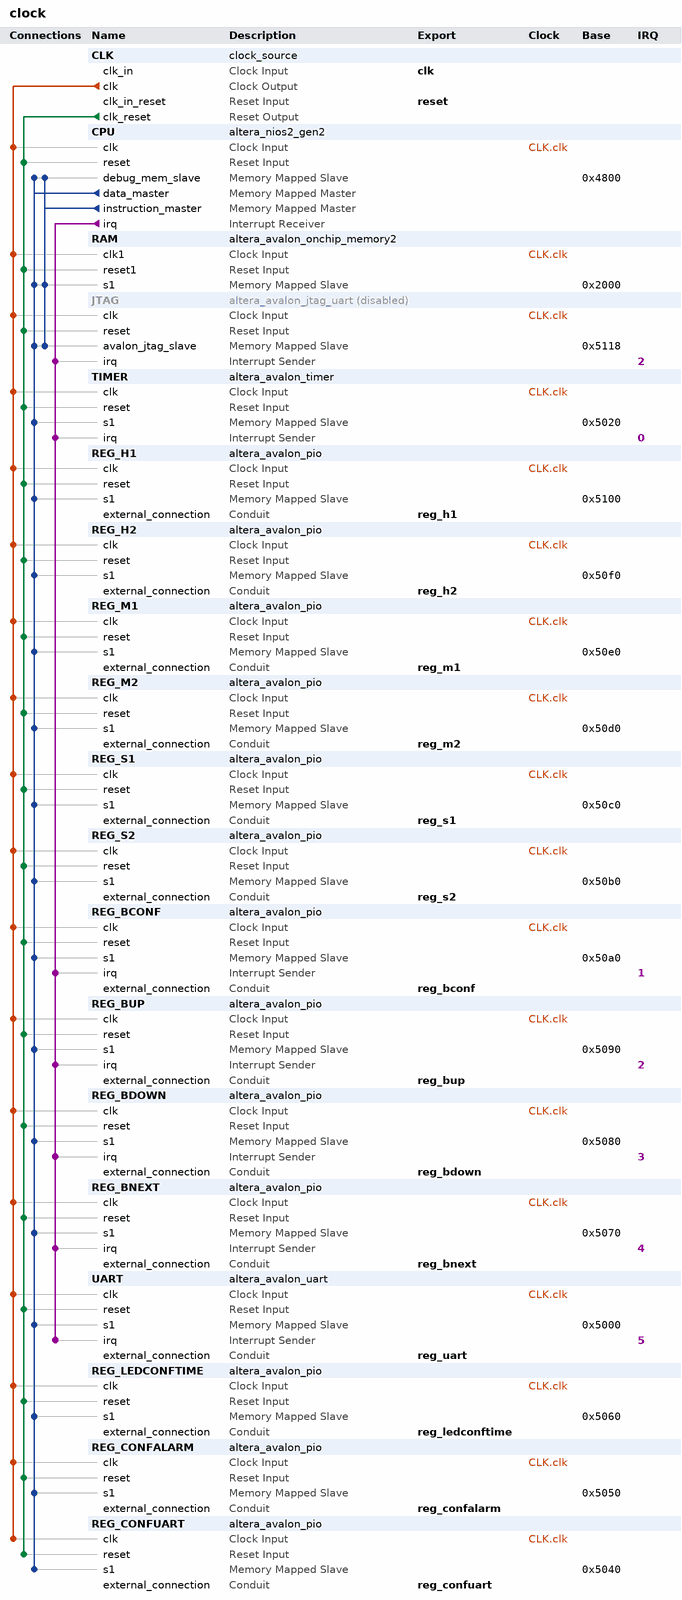
[diagram p0: system contents]
# Platform Designer (Qsys) system clock, Cyclone V 5CSEMA5F31C6
# Parameters at their usual value, and those the tool derives, are not listed.
package require -exact qsys 19.1
create_system clock
set_project_property DEVICE_FAMILY {Cyclone V}
set_project_property DEVICE 5CSEMA5F31C6

add_instance CLK clock_source 19.1
set_instance_parameter_value CLK clockFrequency 50000000

add_instance CPU altera_nios2_gen2 19.1
set_instance_parameter_value CPU dcache_size 2048
set_instance_parameter_value CPU exceptionSlave RAM.s1
set_instance_parameter_value CPU icache_size 4096
set_instance_parameter_value CPU impl Tiny
set_instance_parameter_value CPU resetSlave RAM.s1

add_instance RAM altera_avalon_onchip_memory2 19.1
set_instance_parameter_value RAM dataWidth 32
set_instance_parameter_value RAM dualPort false
set_instance_parameter_value RAM initMemContent true
set_instance_parameter_value RAM initializationFileName C:/Users/este0/OneDrive/Documentos/tec/embebidos_proyecto_2/software/clock_app/mem_init/clock_RAM.hex
set_instance_parameter_value RAM memorySize 8192
set_instance_parameter_value RAM useNonDefaultInitFile true

add_instance JTAG altera_avalon_jtag_uart 19.1
set_instance_property JTAG ENABLED false
set_instance_parameter_value JTAG simInteractiveOptions NO_INTERACTIVE_WINDOWS

add_instance TIMER altera_avalon_timer 19.1
set_instance_parameter_value TIMER period 1
set_instance_parameter_value TIMER periodUnits SEC

add_instance REG_H1 altera_avalon_pio 19.1
set_instance_parameter_value REG_H1 direction Output
set_instance_parameter_value REG_H1 width 7

add_instance REG_H2 altera_avalon_pio 19.1
set_instance_parameter_value REG_H2 direction Output
set_instance_parameter_value REG_H2 width 7

add_instance REG_M1 altera_avalon_pio 19.1
set_instance_parameter_value REG_M1 direction Output
set_instance_parameter_value REG_M1 width 7

add_instance REG_M2 altera_avalon_pio 19.1
set_instance_parameter_value REG_M2 direction Output
set_instance_parameter_value REG_M2 width 7

add_instance REG_S1 altera_avalon_pio 19.1
set_instance_parameter_value REG_S1 direction Output
set_instance_parameter_value REG_S1 width 7

add_instance REG_S2 altera_avalon_pio 19.1
set_instance_parameter_value REG_S2 direction Output
set_instance_parameter_value REG_S2 width 7

add_instance REG_BCONF altera_avalon_pio 19.1
set_instance_parameter_value REG_BCONF captureEdge true
set_instance_parameter_value REG_BCONF direction Input
set_instance_parameter_value REG_BCONF generateIRQ true
set_instance_parameter_value REG_BCONF irqType EDGE
set_instance_parameter_value REG_BCONF simDrivenValue 1
set_instance_parameter_value REG_BCONF width 1

add_instance REG_BUP altera_avalon_pio 19.1
set_instance_parameter_value REG_BUP captureEdge true
set_instance_parameter_value REG_BUP direction Input
set_instance_parameter_value REG_BUP generateIRQ true
set_instance_parameter_value REG_BUP irqType EDGE
set_instance_parameter_value REG_BUP width 1

add_instance REG_BDOWN altera_avalon_pio 19.1
set_instance_parameter_value REG_BDOWN captureEdge true
set_instance_parameter_value REG_BDOWN direction Input
set_instance_parameter_value REG_BDOWN generateIRQ true
set_instance_parameter_value REG_BDOWN irqType EDGE
set_instance_parameter_value REG_BDOWN width 1

add_instance REG_BNEXT altera_avalon_pio 19.1
set_instance_parameter_value REG_BNEXT captureEdge true
set_instance_parameter_value REG_BNEXT direction Input
set_instance_parameter_value REG_BNEXT generateIRQ true
set_instance_parameter_value REG_BNEXT irqType EDGE
set_instance_parameter_value REG_BNEXT width 1

add_instance UART altera_avalon_uart 19.1
set_instance_parameter_value UART baud 115200
set_instance_parameter_value UART dataBits 8
set_instance_parameter_value UART fixedBaud true
set_instance_parameter_value UART parity NONE
set_instance_parameter_value UART stopBits 1

add_instance REG_LEDCONFTIME altera_avalon_pio 19.1
set_instance_parameter_value REG_LEDCONFTIME direction Output
set_instance_parameter_value REG_LEDCONFTIME width 1

add_instance REG_CONFALARM altera_avalon_pio 19.1
set_instance_parameter_value REG_CONFALARM captureEdge true
set_instance_parameter_value REG_CONFALARM direction Output
set_instance_parameter_value REG_CONFALARM generateIRQ true
set_instance_parameter_value REG_CONFALARM irqType EDGE
set_instance_parameter_value REG_CONFALARM width 1

add_instance REG_CONFUART altera_avalon_pio 19.1
set_instance_parameter_value REG_CONFUART direction Output
set_instance_parameter_value REG_CONFUART width 1

# connections
add_connection CLK.clk CPU.clk clock
add_connection CLK.clk JTAG.clk clock
add_connection CLK.clk RAM.clk1 clock
add_connection CLK.clk REG_BCONF.clk clock
add_connection CLK.clk REG_BDOWN.clk clock
add_connection CLK.clk REG_BNEXT.clk clock
add_connection CLK.clk REG_BUP.clk clock
add_connection CLK.clk REG_CONFALARM.clk clock
add_connection CLK.clk REG_CONFUART.clk clock
add_connection CLK.clk REG_H1.clk clock
add_connection CLK.clk REG_H2.clk clock
add_connection CLK.clk REG_LEDCONFTIME.clk clock
add_connection CLK.clk REG_M1.clk clock
add_connection CLK.clk REG_M2.clk clock
add_connection CLK.clk REG_S1.clk clock
add_connection CLK.clk REG_S2.clk clock
add_connection CLK.clk TIMER.clk clock
add_connection CLK.clk UART.clk clock
add_connection CLK.clk_reset CPU.reset reset
add_connection CLK.clk_reset JTAG.reset reset
add_connection CLK.clk_reset RAM.reset1 reset
add_connection CLK.clk_reset REG_BCONF.reset reset
add_connection CLK.clk_reset REG_BDOWN.reset reset
add_connection CLK.clk_reset REG_BNEXT.reset reset
add_connection CLK.clk_reset REG_BUP.reset reset
add_connection CLK.clk_reset REG_CONFALARM.reset reset
add_connection CLK.clk_reset REG_CONFUART.reset reset
add_connection CLK.clk_reset REG_H1.reset reset
add_connection CLK.clk_reset REG_H2.reset reset
add_connection CLK.clk_reset REG_LEDCONFTIME.reset reset
add_connection CLK.clk_reset REG_M1.reset reset
add_connection CLK.clk_reset REG_M2.reset reset
add_connection CLK.clk_reset REG_S1.reset reset
add_connection CLK.clk_reset REG_S2.reset reset
add_connection CLK.clk_reset TIMER.reset reset
add_connection CLK.clk_reset UART.reset reset
add_connection CPU.data_master CPU.debug_mem_slave avalon
set_connection_parameter_value CPU.data_master/CPU.debug_mem_slave baseAddress 0x4800
add_connection CPU.data_master JTAG.avalon_jtag_slave avalon
set_connection_parameter_value CPU.data_master/JTAG.avalon_jtag_slave baseAddress 0x5118
add_connection CPU.data_master RAM.s1 avalon
set_connection_parameter_value CPU.data_master/RAM.s1 baseAddress 0x2000
add_connection CPU.data_master REG_BCONF.s1 avalon
set_connection_parameter_value CPU.data_master/REG_BCONF.s1 baseAddress 0x50a0
add_connection CPU.data_master REG_BDOWN.s1 avalon
set_connection_parameter_value CPU.data_master/REG_BDOWN.s1 baseAddress 0x5080
add_connection CPU.data_master REG_BNEXT.s1 avalon
set_connection_parameter_value CPU.data_master/REG_BNEXT.s1 baseAddress 0x5070
add_connection CPU.data_master REG_BUP.s1 avalon
set_connection_parameter_value CPU.data_master/REG_BUP.s1 baseAddress 0x5090
add_connection CPU.data_master REG_CONFALARM.s1 avalon
set_connection_parameter_value CPU.data_master/REG_CONFALARM.s1 baseAddress 0x5050
add_connection CPU.data_master REG_CONFUART.s1 avalon
set_connection_parameter_value CPU.data_master/REG_CONFUART.s1 baseAddress 0x5040
add_connection CPU.data_master REG_H1.s1 avalon
set_connection_parameter_value CPU.data_master/REG_H1.s1 baseAddress 0x5100
add_connection CPU.data_master REG_H2.s1 avalon
set_connection_parameter_value CPU.data_master/REG_H2.s1 baseAddress 0x50f0
add_connection CPU.data_master REG_LEDCONFTIME.s1 avalon
set_connection_parameter_value CPU.data_master/REG_LEDCONFTIME.s1 baseAddress 0x5060
add_connection CPU.data_master REG_M1.s1 avalon
set_connection_parameter_value CPU.data_master/REG_M1.s1 baseAddress 0x50e0
add_connection CPU.data_master REG_M2.s1 avalon
set_connection_parameter_value CPU.data_master/REG_M2.s1 baseAddress 0x50d0
add_connection CPU.data_master REG_S1.s1 avalon
set_connection_parameter_value CPU.data_master/REG_S1.s1 baseAddress 0x50c0
add_connection CPU.data_master REG_S2.s1 avalon
set_connection_parameter_value CPU.data_master/REG_S2.s1 baseAddress 0x50b0
add_connection CPU.data_master TIMER.s1 avalon
set_connection_parameter_value CPU.data_master/TIMER.s1 baseAddress 0x5020
add_connection CPU.data_master UART.s1 avalon
set_connection_parameter_value CPU.data_master/UART.s1 baseAddress 0x5000
add_connection CPU.instruction_master CPU.debug_mem_slave avalon
set_connection_parameter_value CPU.instruction_master/CPU.debug_mem_slave baseAddress 0x4800
add_connection CPU.instruction_master JTAG.avalon_jtag_slave avalon
set_connection_parameter_value CPU.instruction_master/JTAG.avalon_jtag_slave baseAddress 0x5118
add_connection CPU.instruction_master RAM.s1 avalon
set_connection_parameter_value CPU.instruction_master/RAM.s1 baseAddress 0x2000
add_connection CPU.irq JTAG.irq interrupt
set_connection_parameter_value CPU.irq/JTAG.irq irqNumber 2
add_connection CPU.irq REG_BCONF.irq interrupt
set_connection_parameter_value CPU.irq/REG_BCONF.irq irqNumber 1
add_connection CPU.irq REG_BDOWN.irq interrupt
set_connection_parameter_value CPU.irq/REG_BDOWN.irq irqNumber 3
add_connection CPU.irq REG_BNEXT.irq interrupt
set_connection_parameter_value CPU.irq/REG_BNEXT.irq irqNumber 4
add_connection CPU.irq REG_BUP.irq interrupt
set_connection_parameter_value CPU.irq/REG_BUP.irq irqNumber 2
add_connection CPU.irq TIMER.irq interrupt
set_connection_parameter_value CPU.irq/TIMER.irq irqNumber 0
add_connection CPU.irq UART.irq interrupt
set_connection_parameter_value CPU.irq/UART.irq irqNumber 5

# exported interfaces
add_interface clk clock sink
set_interface_property clk EXPORT_OF CLK.clk_in
add_interface reg_bconf conduit end
set_interface_property reg_bconf EXPORT_OF REG_BCONF.external_connection
add_interface reg_bdown conduit end
set_interface_property reg_bdown EXPORT_OF REG_BDOWN.external_connection
add_interface reg_bnext conduit end
set_interface_property reg_bnext EXPORT_OF REG_BNEXT.external_connection
add_interface reg_bup conduit end
set_interface_property reg_bup EXPORT_OF REG_BUP.external_connection
add_interface reg_confalarm conduit end
set_interface_property reg_confalarm EXPORT_OF REG_CONFALARM.external_connection
add_interface reg_confuart conduit end
set_interface_property reg_confuart EXPORT_OF REG_CONFUART.external_connection
add_interface reg_h1 conduit end
set_interface_property reg_h1 EXPORT_OF REG_H1.external_connection
add_interface reg_h2 conduit end
set_interface_property reg_h2 EXPORT_OF REG_H2.external_connection
add_interface reg_ledconftime conduit end
set_interface_property reg_ledconftime EXPORT_OF REG_LEDCONFTIME.external_connection
add_interface reg_m1 conduit end
set_interface_property reg_m1 EXPORT_OF REG_M1.external_connection
add_interface reg_m2 conduit end
set_interface_property reg_m2 EXPORT_OF REG_M2.external_connection
add_interface reg_s1 conduit end
set_interface_property reg_s1 EXPORT_OF REG_S1.external_connection
add_interface reg_s2 conduit end
set_interface_property reg_s2 EXPORT_OF REG_S2.external_connection
add_interface reg_uart conduit end
set_interface_property reg_uart EXPORT_OF UART.external_connection
add_interface reset reset sink
set_interface_property reset EXPORT_OF CLK.clk_in_reset

set_interconnect_requirement {$system} qsys_mm.clockCrossingAdapter HANDSHAKE
set_interconnect_requirement {$system} qsys_mm.enableEccProtection FALSE
set_interconnect_requirement {$system} qsys_mm.insertDefaultSlave FALSE
set_interconnect_requirement {$system} qsys_mm.maxAdditionalLatency 1

save_system clock.qsys
